# Altium schematic sheet Max3100Uart.SchDoc
size A; PageSetup: Record=PageOptions|CenterHorizontal=True|CenterVertical=True|PrintScale=1.00|XCorrection=1.00|YCorrection=1.00|PrintKind=1|BorderSize=5000000|LeftOffset=0|BottomOffset=0|Orientation=2|PaperLength=1000|PaperWidth=1000|Scale=100|PaperSource=7|PrintQuality=-4|MediaType=1|DitherType=10|PaperKind=A4|PrintScaleMode=1
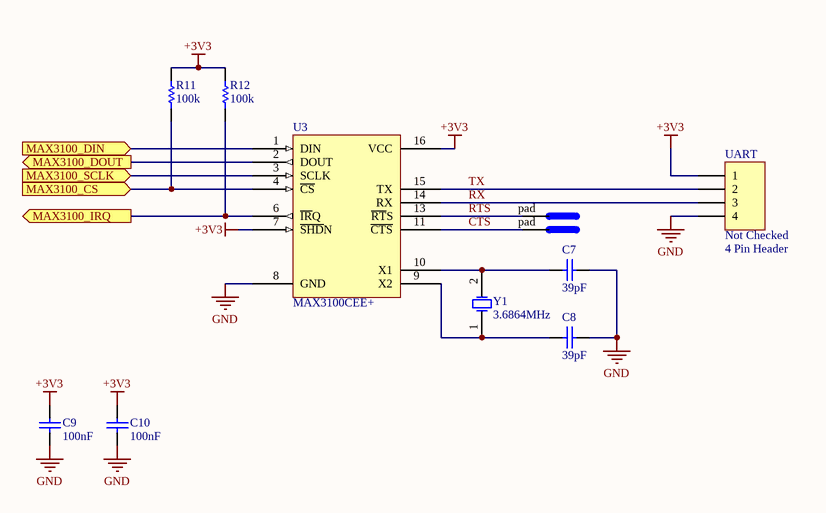
[diagram p0: Max3100Uart.SchDoc]

## Parts
C7  value 39pF  [0603]  (hidden comment: Cap)
C8  value 39pF  [0603]  (hidden comment: Cap)
C9  100nF  [0603]
C10  100nF  [0603]
CTS  (no value)  [PAD_ROUND]
R11  100k  [0603]
R12  100k  [0603]
RTS  (no value)  [PAD_ROUND]
U3  MAX3100CEE+  [QSOP16_MAX3100]
UART  Verify: Not Checked  [CONN_4X1_SMT_RA_1.25MM]  (hidden comment: 4 Pin Header)
Y1  3.6864MHz  [HC49/4h_SMX]

## Ports
MAX3100_CS (in), MAX3100_DIN (in), MAX3100_DOUT (out), MAX3100_IRQ (out), MAX3100_SCLK (in)

## Nets
+3V3: C9.2 C10.2 R11.2 R12.2 U3.7(~{SHD}N) U3.16(VCC) UART.1
GND: C7.2 C8.1 C9.1 C10.1 U3.8(GND) UART.4
CTS: CTS.pad U3.11(~{CTS})
MAX3100_CS: R11.1 U3.4(~{CS}) ; port MAX3100_CS
MAX3100_DIN: U3.1(DIN) ; port MAX3100_DIN
MAX3100_DOUT: U3.2(DOUT) ; port MAX3100_DOUT
MAX3100_IRQ: R12.1 U3.6(~{IR}Q) ; port MAX3100_IRQ
MAX3100_SCLK: U3.3(SCLK) ; port MAX3100_SCLK
RTS: RTS.pad U3.13(~{RT}S)
RX: U3.14(RX) UART.3
TX: U3.15(TX) UART.2
NetC7_1: C7.1 U3.10(X1) Y1.2(OSC2)
NetC8_2: C8.2 U3.9(X2) Y1.1(OSC1)

## Library data of the parts
C7 C8 = Cap: Capacitor; Published: 8-Jun-2000; LatestRevisionDate: 17-Jul-2002; LatestRevisionNote: Re-released for DXP Platform.; PackageReference: RAD-0.3; Publisher: Altium Limited
C9 C10 = CP_100nF 0603: CAP CER .10UF 50V X5R 0603; Manufacturer: Taiyo Yuden; Manufacturer PN: UMK107B7104KA-T; Prototype: Digikey 587-1243-1-ND; LatestRevisionDate: 29 May 08; Value: 100nF
CTS RTS = JP_pad: Pad; pin to pad: pad>1
R11 R12 = RS_100k 0603: RES 100K OHM 1/10W 1% 0603 SMD; Manufacturer: Yageo; Manufacturer PN: RC0603FR-07100KL; Prototype: DigiKey 311-100KHRCT-ND; LatestRevisionDate: 1 Jun 08; Value: 100k
U3 = IC_MAX3100: SPI UART
UART = JP_4PIN HDR_SMT_RA_MOLEX_1: CONN HDR VERT 4POS .100" SNGL; Manufacturer: Molex; Manufacturer PN: 53261-0471; Prototype: Digikey WM7622CT-ND; LatestRevisionDate: 24 Jun 08; Value: 4 Pin Header
Y1 = XTAL: Crystal Oscillator; Manufacturer PN: ECS-36-20-5P; Manufacturer: ECS; Prototype: Digikey, XC562CT-ND; Published: 8-Jun-2000; LatestRevisionDate: 17-Jul-2002; LatestRevisionNote: Re-released for DXP Platform.; PackageReference: R38; Publisher: Altium Limited